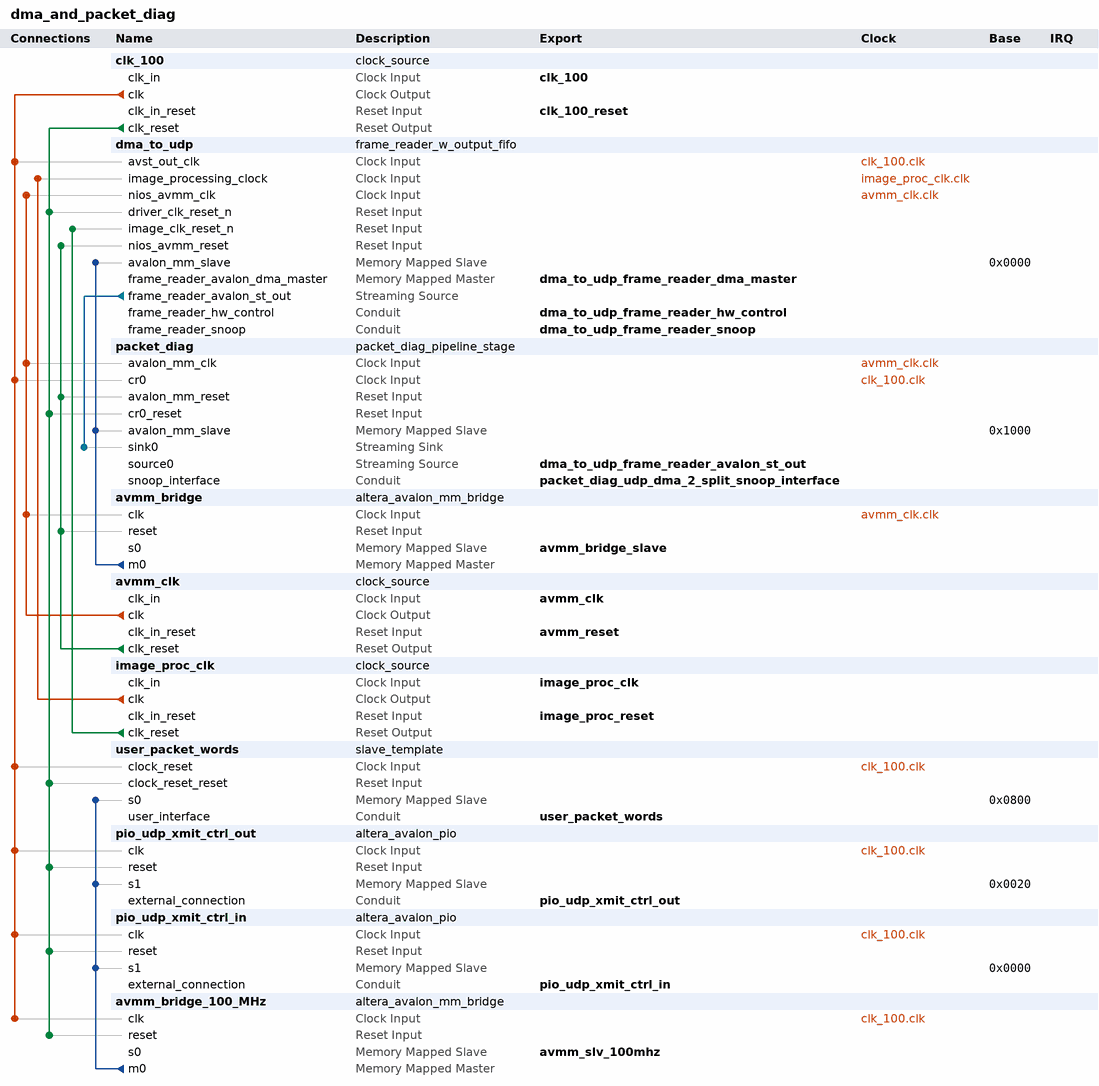
[diagram p0: system contents]
# Platform Designer (Qsys) system dma_and_packet_diag, Arria 10 10AS066H2F34I1SG
# Parameters at their usual value, and those the tool derives, are not listed.
package require -exact qsys 18.1
create_system dma_and_packet_diag
set_project_property DEVICE_FAMILY {Arria 10}
set_project_property DEVICE 10AS066H2F34I1SG

add_instance clk_100 clock_source 18.1
set_instance_parameter_value clk_100 clockFrequency 100000000
set_instance_parameter_value clk_100 resetSynchronousEdges BOTH

add_instance dma_to_udp frame_reader_w_output_fifo 1.0
set_instance_parameter_value dma_to_udp address_width 32
set_instance_parameter_value dma_to_udp dma_enabled_at_startup 0
set_instance_parameter_value dma_to_udp num_of_bits_per_pixel 32
set_instance_parameter_value dma_to_udp num_of_locations_in_fifo 32
set_instance_parameter_value dma_to_udp num_of_pixels_in_frame 16777216
set_instance_parameter_value dma_to_udp num_watchdog_bits 32
set_instance_parameter_value dma_to_udp override_external_swap_buffers_now 1
set_instance_parameter_value dma_to_udp override_val_for_external_swap_buffers_now 1
set_instance_parameter_value dma_to_udp parallelization_ratio 8
set_instance_parameter_value dma_to_udp swap_symbol_order_for_dma 1

add_instance packet_diag packet_diag_pipeline_stage 14.1
set_instance_parameter_value packet_diag BITS_PER_SYMBOL 32
set_instance_parameter_value packet_diag CHANNEL_WIDTH 0
set_instance_parameter_value packet_diag DEFAULT_VALID_PACKET_LENGTH 1024
set_instance_parameter_value packet_diag ENABLE_PACKET_STATISTICS 1
set_instance_parameter_value packet_diag ERROR_WIDTH 0
set_instance_parameter_value packet_diag MAX_CHANNEL 0
set_instance_parameter_value packet_diag NUM_COMPARED_PACKETS 1
set_instance_parameter_value packet_diag NUM_OF_COUNTER_BITS 24
set_instance_parameter_value packet_diag PIPELINE_READY 1
set_instance_parameter_value packet_diag SYMBOLS_PER_BEAT 1
set_instance_parameter_value packet_diag USE_EMPTY 0
set_instance_parameter_value packet_diag USE_PACKETS 1

add_instance avmm_bridge altera_avalon_mm_bridge 18.1
set_instance_parameter_value avmm_bridge ADDRESS_UNITS SYMBOLS
set_instance_parameter_value avmm_bridge ADDRESS_WIDTH 10
set_instance_parameter_value avmm_bridge DATA_WIDTH 32
set_instance_parameter_value avmm_bridge MAX_PENDING_RESPONSES 4
set_instance_parameter_value avmm_bridge USE_AUTO_ADDRESS_WIDTH 1

add_instance avmm_clk clock_source 18.1
set_instance_parameter_value avmm_clk clockFrequency 50000000
set_instance_parameter_value avmm_clk resetSynchronousEdges DEASSERT

add_instance image_proc_clk clock_source 18.1
set_instance_parameter_value image_proc_clk clockFrequency 150000000
set_instance_parameter_value image_proc_clk resetSynchronousEdges BOTH

add_instance user_packet_words slave_template 2.0
set_instance_parameter_value user_packet_words DATA_WIDTH 32
set_instance_parameter_value user_packet_words ENABLE_SYNC_SIGNALS 0
set_instance_parameter_value user_packet_words IRQ_EN 0
set_instance_parameter_value user_packet_words MODE_0 3
set_instance_parameter_value user_packet_words MODE_1 3
set_instance_parameter_value user_packet_words MODE_10 4
set_instance_parameter_value user_packet_words MODE_11 4
set_instance_parameter_value user_packet_words MODE_12 4
set_instance_parameter_value user_packet_words MODE_13 4
set_instance_parameter_value user_packet_words MODE_14 4
set_instance_parameter_value user_packet_words MODE_15 4
set_instance_parameter_value user_packet_words MODE_2 3
set_instance_parameter_value user_packet_words MODE_3 3
set_instance_parameter_value user_packet_words MODE_4 4
set_instance_parameter_value user_packet_words MODE_5 4
set_instance_parameter_value user_packet_words MODE_6 4
set_instance_parameter_value user_packet_words MODE_7 4
set_instance_parameter_value user_packet_words MODE_8 4
set_instance_parameter_value user_packet_words MODE_9 4

add_instance pio_udp_xmit_ctrl_out altera_avalon_pio 18.1
set_instance_parameter_value pio_udp_xmit_ctrl_out direction Output
set_instance_parameter_value pio_udp_xmit_ctrl_out width 3

add_instance pio_udp_xmit_ctrl_in altera_avalon_pio 18.1
set_instance_parameter_value pio_udp_xmit_ctrl_in direction Input
set_instance_parameter_value pio_udp_xmit_ctrl_in width 1

add_instance avmm_bridge_100_MHz altera_avalon_mm_bridge 18.1
set_instance_parameter_value avmm_bridge_100_MHz ADDRESS_UNITS SYMBOLS
set_instance_parameter_value avmm_bridge_100_MHz ADDRESS_WIDTH 10
set_instance_parameter_value avmm_bridge_100_MHz DATA_WIDTH 32
set_instance_parameter_value avmm_bridge_100_MHz MAX_PENDING_RESPONSES 4
set_instance_parameter_value avmm_bridge_100_MHz USE_AUTO_ADDRESS_WIDTH 1

# connections
add_connection avmm_clk.clk avmm_bridge.clk clock
add_connection avmm_clk.clk dma_to_udp.nios_avmm_clk clock
add_connection avmm_clk.clk packet_diag.avalon_mm_clk clock
add_connection clk_100.clk avmm_bridge_100_MHz.clk clock
add_connection clk_100.clk dma_to_udp.avst_out_clk clock
add_connection clk_100.clk packet_diag.cr0 clock
add_connection clk_100.clk pio_udp_xmit_ctrl_in.clk clock
add_connection clk_100.clk pio_udp_xmit_ctrl_out.clk clock
add_connection clk_100.clk user_packet_words.clock_reset clock
add_connection image_proc_clk.clk dma_to_udp.image_processing_clock clock
add_connection avmm_clk.clk_reset avmm_bridge.reset reset
add_connection avmm_clk.clk_reset dma_to_udp.nios_avmm_reset reset
add_connection avmm_clk.clk_reset packet_diag.avalon_mm_reset reset
add_connection clk_100.clk_reset avmm_bridge_100_MHz.reset reset
add_connection clk_100.clk_reset dma_to_udp.driver_clk_reset_n reset
add_connection clk_100.clk_reset packet_diag.cr0_reset reset
add_connection clk_100.clk_reset pio_udp_xmit_ctrl_in.reset reset
add_connection clk_100.clk_reset pio_udp_xmit_ctrl_out.reset reset
add_connection clk_100.clk_reset user_packet_words.clock_reset_reset reset
add_connection image_proc_clk.clk_reset dma_to_udp.image_clk_reset_n reset
add_connection avmm_bridge.m0 dma_to_udp.avalon_mm_slave avalon
set_connection_parameter_value avmm_bridge.m0/dma_to_udp.avalon_mm_slave baseAddress 0x0000
add_connection avmm_bridge.m0 packet_diag.avalon_mm_slave avalon
set_connection_parameter_value avmm_bridge.m0/packet_diag.avalon_mm_slave baseAddress 0x1000
add_connection avmm_bridge_100_MHz.m0 pio_udp_xmit_ctrl_in.s1 avalon
set_connection_parameter_value avmm_bridge_100_MHz.m0/pio_udp_xmit_ctrl_in.s1 baseAddress 0x0000
add_connection avmm_bridge_100_MHz.m0 pio_udp_xmit_ctrl_out.s1 avalon
set_connection_parameter_value avmm_bridge_100_MHz.m0/pio_udp_xmit_ctrl_out.s1 baseAddress 0x0020
add_connection avmm_bridge_100_MHz.m0 user_packet_words.s0 avalon
set_connection_parameter_value avmm_bridge_100_MHz.m0/user_packet_words.s0 baseAddress 0x0800
add_connection dma_to_udp.frame_reader_avalon_st_out packet_diag.sink0 avalon_streaming

# exported interfaces
add_interface avmm_bridge_slave avalon slave
set_interface_property avmm_bridge_slave EXPORT_OF avmm_bridge.s0
add_interface avmm_clk clock sink
set_interface_property avmm_clk EXPORT_OF avmm_clk.clk_in
add_interface avmm_reset reset sink
set_interface_property avmm_reset EXPORT_OF avmm_clk.clk_in_reset
add_interface avmm_slv_100mhz avalon slave
set_interface_property avmm_slv_100mhz EXPORT_OF avmm_bridge_100_MHz.s0
add_interface clk_100 clock sink
set_interface_property clk_100 EXPORT_OF clk_100.clk_in
add_interface clk_100_reset reset sink
set_interface_property clk_100_reset EXPORT_OF clk_100.clk_in_reset
add_interface dma_to_udp_frame_reader_avalon_st_out avalon_streaming source
set_interface_property dma_to_udp_frame_reader_avalon_st_out EXPORT_OF packet_diag.source0
add_interface dma_to_udp_frame_reader_dma_master avalon master
set_interface_property dma_to_udp_frame_reader_dma_master EXPORT_OF dma_to_udp.frame_reader_avalon_dma_master
add_interface dma_to_udp_frame_reader_hw_control conduit end
set_interface_property dma_to_udp_frame_reader_hw_control EXPORT_OF dma_to_udp.frame_reader_hw_control
add_interface dma_to_udp_frame_reader_snoop conduit end
set_interface_property dma_to_udp_frame_reader_snoop EXPORT_OF dma_to_udp.frame_reader_snoop
add_interface image_proc_clk clock sink
set_interface_property image_proc_clk EXPORT_OF image_proc_clk.clk_in
add_interface image_proc_reset reset sink
set_interface_property image_proc_reset EXPORT_OF image_proc_clk.clk_in_reset
add_interface packet_diag_udp_dma_2_split_snoop_interface conduit end
set_interface_property packet_diag_udp_dma_2_split_snoop_interface EXPORT_OF packet_diag.snoop_interface
add_interface pio_udp_xmit_ctrl_in conduit end
set_interface_property pio_udp_xmit_ctrl_in EXPORT_OF pio_udp_xmit_ctrl_in.external_connection
add_interface pio_udp_xmit_ctrl_out conduit end
set_interface_property pio_udp_xmit_ctrl_out EXPORT_OF pio_udp_xmit_ctrl_out.external_connection
add_interface user_packet_words conduit end
set_interface_property user_packet_words EXPORT_OF user_packet_words.user_interface

set_interconnect_requirement {$system} qsys_mm.clockCrossingAdapter HANDSHAKE
set_interconnect_requirement {$system} qsys_mm.insertDefaultSlave FALSE
set_interconnect_requirement {$system} qsys_mm.maxAdditionalLatency 4

save_system dma_and_packet_diag.qsys
